# EAGLE design 7474-strobe-generator-v3a (EAGLE 9.4.1)
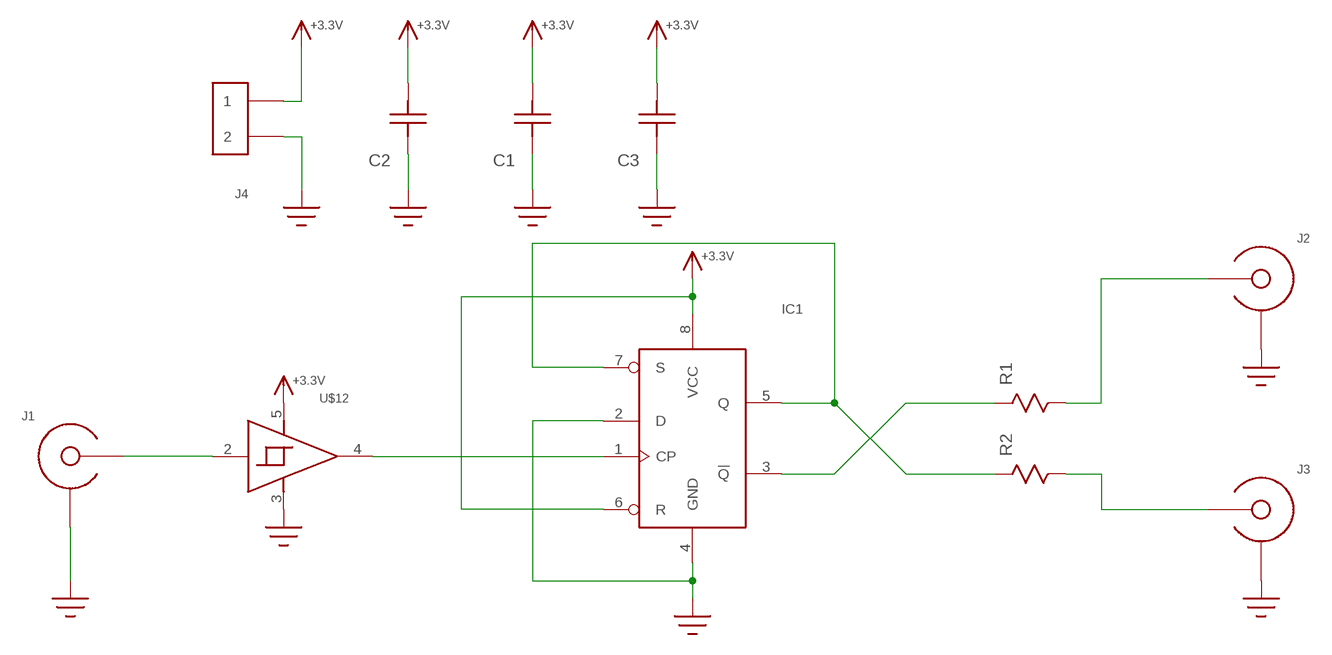
[diagram p0: schematic, sheet 1]

## Parts
C1  C0603  [C0603]
C2  C1206  [1206]
C3  C0603  [C0603]
IC1  74LVC2G74  [SSOP8]
J1  SMA-EDGE-LAUNCH4020_TAPER  [SMA_EDGE_LAUNCH_2L_4020_TAPER]
J2  SMA-EDGE-LAUNCH4020_TAPER  [SMA_EDGE_LAUNCH_2L_4020_TAPER]
J3  SMA-EDGE-LAUNCH4020_TAPER  [SMA_EDGE_LAUNCH_2L_4020_TAPER]
J4  HEADER_2PIN  [HEADER_2PIN]
R1  R0603  [R0603]
R2  R0603  [R0603]
U$12  74LVC1G17  [SOT23-5]

## Nets
+3.3V: C1.P$1 C2.P$1 C3.P$1 IC1.6(R) IC1.8(VCC) J4.1 U$12.5(VCC)
GND: C1.P$2 C2.P$2 C3.P$2 IC1.2(D) IC1.4(GND) J1.BOTTOM_GND(SHIELD) J1.GND@1(SHIELD) J1.GND@2(SHIELD) J1.GND@3(SHIELD) J1.GND@4(SHIELD) J1.GND@5(SHIELD) J1.GND@6(SHIELD) J1.GND@7(SHIELD) J1.GND@8(SHIELD) J1.GND@14(SHIELD) J1.GND@15(SHIELD) J1.GND@16(SHIELD) J1.GND@17(SHIELD) J1.GND_PAD1(SHIELD) J1.GND_PAD2(SHIELD) J1.P$1(SHIELD) J1.P$2(SHIELD) J2.BOTTOM_GND(SHIELD) J2.GND@1(SHIELD) J2.GND@2(SHIELD) J2.GND@3(SHIELD) J2.GND@4(SHIELD) J2.GND@5(SHIELD) J2.GND@6(SHIELD) J2.GND@7(SHIELD) J2.GND@8(SHIELD) J2.GND@14(SHIELD) J2.GND@15(SHIELD) J2.GND@16(SHIELD) J2.GND@17(SHIELD) J2.GND_PAD1(SHIELD) J2.GND_PAD2(SHIELD) J2.P$1(SHIELD) J2.P$2(SHIELD) J3.BOTTOM_GND(SHIELD) J3.GND@1(SHIELD) J3.GND@2(SHIELD) J3.GND@3(SHIELD) J3.GND@4(SHIELD) J3.GND@5(SHIELD) J3.GND@6(SHIELD) J3.GND@7(SHIELD) J3.GND@8(SHIELD) J3.GND@14(SHIELD) J3.GND@15(SHIELD) J3.GND@16(SHIELD) J3.GND@17(SHIELD) J3.GND_PAD1(SHIELD) J3.GND_PAD2(SHIELD) J3.P$1(SHIELD) J3.P$2(SHIELD) J4.2 U$12.3(GND)
N$1: IC1.1(CP) U$12.4(OUT)
N$2: IC1.3(!Q!) R1.P$1
N$3 [29-6]: J2.CENTER@1(CENTER) R1.P$2
N$5 [29-6]: J3.CENTER@1(CENTER) R2.P$2
N$6: J1.CENTER@1(CENTER) U$12.2(IN)
N$8: IC1.5(Q) IC1.7(S) R2.P$1

## Library data of the parts
C1-C3 = yapo:C
IC1 = yapo:74LVC2G74
J1-J3 = yapo:SMA-EDGE-LAUNCH
J4 = yapo:HEADER_2PIN
R1 R2 = yapo:R
U$12 = yapo:74LVC1G17

## Net classes
1 29-6: width 0.737 mm, clearance 0.152 mm

## Board
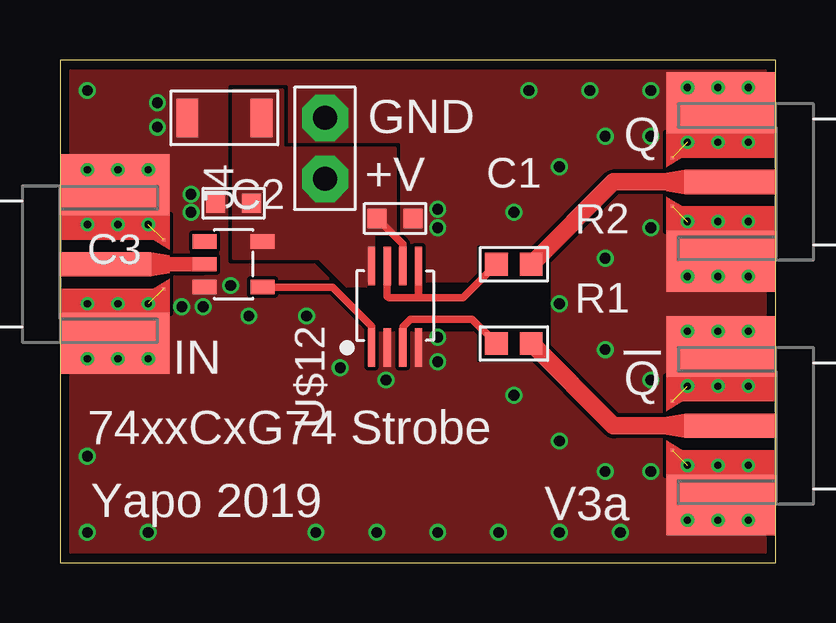
[diagram p1: board, top side]
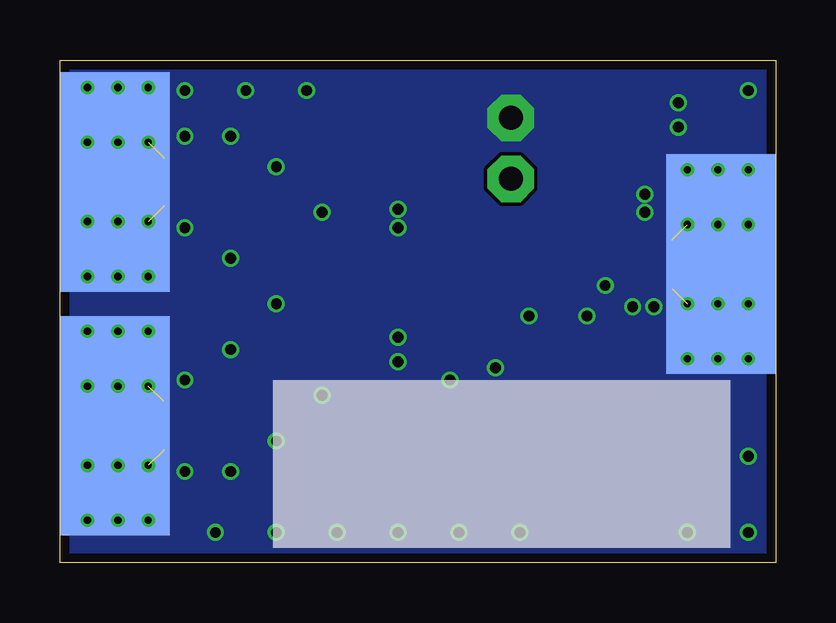
[diagram p2: board, bottom side, seen from below]

Size 29.84 x 20.95 mm. Coordinates in mm from the lower left corner, seen from the top.
Outline: 0,0 29.84,0 29.84,20.95 0,20.95 0,0
Copper layers (1*16): Top 0.035559375mm / dielectric 1.6mm / Bottom 0.035559375mm
Design rules "oshpark-2layer *": minimum track width 6mil, minimum drill 10mil, track to track 6mil, track to pad 6mil, pad to pad 6mil, via to via 6mil, smd to smd 6mil, copper to edge 15mil, drill to drill 6mil, minimum pad ring 5mil, minimum via ring 5mil, stop-mask expansion 2.5mil, vias tented up to drill 20mil, thermal gap 10mil

### Footprints (pad centres in the part's own frame; a part is rotated, then mirrored left to right if it is on the bottom)
C0603 = smd 0.8 x 0.8: P$1 -0.75,0; P$2 0.75,0
1206 = smd 0.9 x 1.6: P$1 -1.55,0; P$2 1.55,0
SSOP8 = smd 0.3 x 1.6: 1 -0.975,-1.7; 2 -0.325,-1.7; 3 0.325,-1.7; 4 0.975,-1.7; 5 0.975,1.7; 6 0.325,1.7; 7 -0.325,1.7; 8 -0.975,1.7
SMA_EDGE_LAUNCH_2L_4020_TAPER = smd 4.572 x 9.144 bottom: BOTTOM_GND 2.286,0 | smd 3.81 x 1.016: CENTER@1 1.905,0 | drill 0.3: GND@1 1.143,3.937; GND@2 3.683,3.937; GND@3 1.143,1.651; GND@4 3.683,1.651; GND@5 1.143,-1.651; GND@6 3.683,-1.651; GND@7 1.143,-3.937; GND@8 3.683,-3.937; GND@14 2.413,3.937; GND@15 2.413,-3.937; GND@16 2.413,-1.651; GND@17 2.413,1.651 | smd 4.572 x 2.54: GND_PAD1 2.286,3.302; GND_PAD2 2.286,-3.302 | smd 0.127 x 0.127: P$1 4.318,1.016; P$2 4.318,-1.016
HEADER_2PIN = drill 1 pad 1.93 octagon: 1 -1.27,0; 2 1.27,0
R0603 = smd 0.95 x 0.95: P$1 -0.725,0; P$2 0.725,0
SOT23-5 = smd 0.6 x 1: 1 -0.95,-1.2; 2 0,-1.2; 3 0.95,-1.2; 4 0.95,1.2; 5 -0.95,1.2

### Placement (x,y rotation side)
C1  13.97,14.35 0 top
C2  6.86,18.54 180 top
C3  7.24,14.99 180 top
IC1  13.97,10.67 0 top
J1  0,12.45 0 top
J2  29.84,5.71 180 top
J3  29.84,15.88 180 top
J4  11.05,17.27 90 top
R1  18.92,9.14 0 top
R2  18.92,12.45 0 top
U$12  7.24,12.45 270 top

### Tracks (layer width: path | path; a pad name or v marks a point on that pad's centre or on a via)
+3.3V
  Top 0.305: IC1.6 14.29,13.28 C1.P$1
  pour Top (no thermals): 7.24,19.68 9.27,19.68 9.27,17.27 13.97,17.27 13.97,13.72 13.08,13.72 13.08,11.56 11.94,11.56 10.79,12.7 7.24,12.7
GND  (via drill 0.45)  (6 unrouted)
  other vias: 15.75,14.73 15.75,13.97 24.64,17.78 24.64,13.97 22.73,17.78 22.73,12.7 20.83,16.51 18.92,14.61 20.83,10.79 24.64,7.62 24.64,3.81 22.73,3.81 22.73,8.89 20.83,5.08 18.92,6.99 1.14,19.68 1.14,1.27 1.14,4.45 3.68,1.27 10.67,1.27 13.21,1.27 15.75,1.27 18.29,1.27 20.83,1.27 23.37,1.27 24.64,19.68 22.1,19.68 19.56,19.68 4.06,19.18 4.06,18.16 5.46,15.37 5.46,14.61 7.11,11.56 5.97,10.67 5.08,10.67 10.29,10.29 7.87,10.29 15.75,9.4 15.75,8.38 13.59,7.62 11.68,8.13
  pour Bottom (rank 2, no thermals): 0,0 0,20.95 29.84,20.95 29.84,0
  pour Top (rank 2, no thermals): 0,0 0,20.95 29.84,20.95 29.84,0
  cutout Top: 17.4,13.21 20.45,13.21 20.45,11.68 17.4,11.68
  cutout Top: 17.4,9.91 20.45,9.91 20.45,8.38 17.4,8.38
  cutout Top: 12.83,11.68 12.83,9.65 20.45,9.65 20.45,11.68
N$1
  Top 0.305: IC1.1 12.99,9.87 11.36,11.5 U$12.4
N$2
  Top 0.305: IC1.3 14.29,9.85 14.61,10.16 17.18,10.16 R1.P$1
N$3
  Top 0.737: J2.CENTER@1 23.08,5.71 R1.P$2
N$5
  Top 0.737: J3.CENTER@1 23.08,15.88 R2.P$2
N$6
  Top 0.61: J1.CENTER@1 U$12.2
N$8
  Top 0.305: R2.P$1 16.8,11.05 14.99,11.05 | IC1.7 13.64,11.12 13.72,11.05 14.99,11.05 | IC1.5 14.95,11.09 14.99,11.05

### Text on the board
tPlace: GND | Q | +V | IN | !Q! | 74xxCxG74 Strobe | Yapo 2019 | V3a